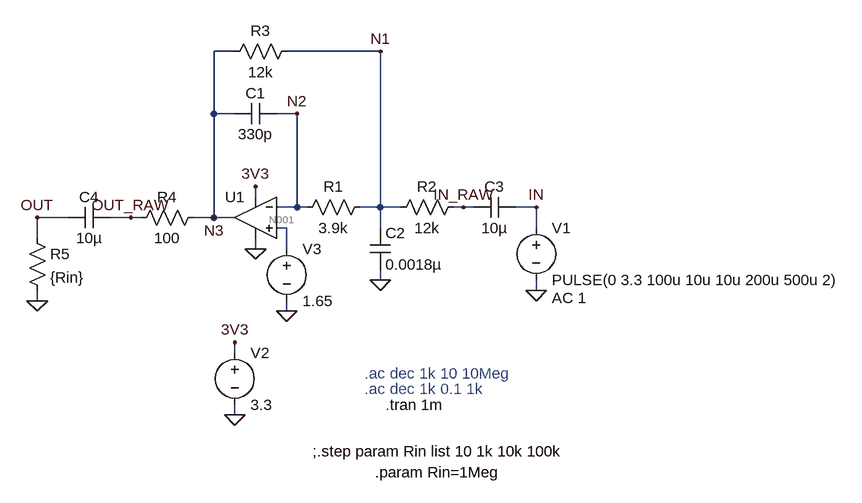
[diagram p0: schematic Preamp.asc]
Preamp.asc, the LTspice schematic file:
Version 4
SHEET 1 1140 680
WIRE 176 -96 144 -96
WIRE 400 -96 256 -96
WIRE 144 0 144 -96
WIRE 176 0 144 0
WIRE 272 0 240 0
WIRE 208 128 208 112
WIRE 272 144 272 0
WIRE 272 144 240 144
WIRE 288 144 272 144
WIRE 400 144 400 -96
WIRE 400 144 368 144
WIRE 432 144 400 144
WIRE 528 144 512 144
WIRE 544 144 528 144
WIRE 640 144 608 144
WIRE -80 160 -128 160
WIRE 16 160 -16 160
WIRE 32 160 16 160
WIRE 144 160 144 0
WIRE 144 160 112 160
WIRE 176 160 144 160
WIRE 256 176 240 176
WIRE 400 176 400 144
WIRE 640 176 640 144
WIRE -128 192 -128 160
WIRE 208 208 208 192
WIRE 256 208 256 176
WIRE 400 256 400 240
WIRE 640 272 640 256
WIRE -128 288 -128 272
WIRE 256 304 256 288
WIRE 176 368 176 352
WIRE 176 464 176 448
FLAG 208 208 0
FLAG 208 112 3V3
FLAG -128 288 0
FLAG 400 256 0
FLAG 640 272 0
FLAG 640 144 IN
FLAG -128 160 OUT
FLAG 16 160 OUT_RAW
FLAG 528 144 IN_RAW
FLAG 400 -96 N1
FLAG 272 0 N2
FLAG 144 160 N3
FLAG 176 464 0
FLAG 176 352 3V3
FLAG 256 304 0
SYMBOL OpAmps\\UniversalOpAmp2 208 160 M0
SYMATTR InstName U1
SYMBOL cap 240 -16 R90
WINDOW 0 0 32 VBottom 2
WINDOW 3 32 32 VTop 2
SYMATTR InstName C1
SYMATTR Value 330p
SYMBOL res 384 128 R90
WINDOW 0 0 56 VBottom 2
WINDOW 3 32 56 VTop 2
SYMATTR InstName R1
SYMATTR Value 3.9k
SYMBOL res 528 128 R90
WINDOW 0 0 56 VBottom 2
WINDOW 3 32 56 VTop 2
SYMATTR InstName R2
SYMATTR Value 12k
SYMBOL res 272 -112 R90
WINDOW 0 0 56 VBottom 2
WINDOW 3 32 56 VTop 2
SYMATTR InstName R3
SYMATTR Value 12k
SYMBOL cap 384 176 R0
SYMATTR InstName C2
SYMATTR Value 0.0018µ
SYMBOL cap 608 128 R90
WINDOW 0 0 32 VBottom 2
WINDOW 3 32 32 VTop 2
SYMATTR InstName C3
SYMATTR Value 10µ
SYMBOL res 128 144 R90
WINDOW 0 0 56 VBottom 2
WINDOW 3 32 56 VTop 2
SYMATTR InstName R4
SYMATTR Value 100
SYMBOL cap -16 144 R90
WINDOW 0 0 32 VBottom 2
WINDOW 3 32 32 VTop 2
SYMATTR InstName C4
SYMATTR Value 10µ
SYMBOL res -144 176 R0
SYMATTR InstName R5
SYMATTR Value {Rin}
SYMBOL voltage 640 160 R0
WINDOW 123 24 124 Left 2
WINDOW 39 0 0 Left 0
SYMATTR InstName V1
SYMATTR Value PULSE(0 3.3 100u 10u 10u 200u 500u 2)
SYMATTR Value2 AC 1
SYMBOL voltage 176 352 R0
WINDOW 123 0 0 Left 0
WINDOW 39 0 0 Left 0
SYMATTR InstName V2
SYMATTR Value 3.3
SYMBOL voltage 256 192 R0
WINDOW 123 0 0 Left 0
WINDOW 39 0 0 Left 0
SYMATTR InstName V3
SYMATTR Value 1.65
TEXT 376 400 Left 2 ;.ac dec 1k 10 10Meg
TEXT 376 424 Left 2 ;.ac dec 1k 0.1 1k
TEXT 296 520 Left 2 !;.step param Rin list 10 1k 10k 100k
TEXT 392 552 Left 2 !.param Rin=1Meg
TEXT 408 448 Left 2 !.tran 1m

The netlist it stands for:
* Preamp.asc
XU1 N001 N2 3V3 0 N3 level2 Avol=1Meg GBW=10Meg Slew=10Meg Ilimit=25m Rail=0 Vos=0 En=0 Enk=0 In=0 Ink=0 Rin=500Meg  ; pins In+ In- V+ V- OUT
C1 N2 N3 330p
R1 N1 N2 3.9k
R2 IN_RAW N1 12k
R3 N1 N3 12k
C2 N1 0 0.0018µ
C3 IN IN_RAW 10µ
R4 N3 OUT_RAW 100
C4 OUT_RAW OUT 10µ
R5 OUT 0 {Rin}
V1 IN 0 PULSE(0 3.3 100u 10u 10u 200u 500u 2) AC 1
V2 3V3 0 3.3
V3 N001 0 1.65
* .ac dec 1k 10 10Meg
* .ac dec 1k 0.1 1k
;.step param Rin list 10 1k 10k 100k
.param Rin=1Meg
.tran 1m
.lib UniversalOpAmp2.lib
.backanno
.end

* Results of the author's LTspice run, read from the files saved beside the schematic
* Operating Point, zero values left out:
*   V(n3) = 1.65 V
*   V(3v3) = 3.3 V
*   V(n2) = 1.65 V
*   V(n001) = 1.65 V
*   V(n1) = 1.65 V
*   V(in_raw) = 1.65 V
*   V(out_raw) = 1.65 V
*   I(V2) = -165 µA
*   Ix(u1:3) = 165 µA
*   Ix(u1:4) = -165 µA
*   Ix(u1:5) = 37.41 pA
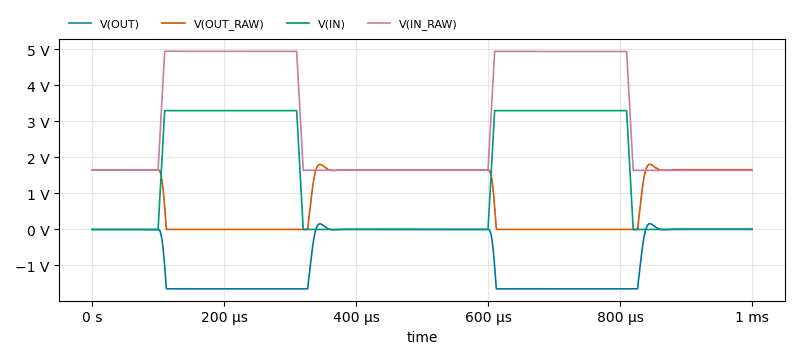
[diagram p1: Transient Analysis of Preamp.asc, plotted from the saved traces]
* Transient Analysis, 1 run:
*   V(OUT): min -1.649 V, max 161.6 mV, average -730.1 mV, rms 1.093 V, last 8.87 mV
*   V(OUT_RAW): min 1.364 mV, max 1.812 V, average 919.9 mV, rms 1.228 V, last 1.659 V
*   V(IN): min 0 V, max 3.3 V, average 1.386 V, rms 2.122 V, last 0 V
*   V(IN_RAW): min 1.641 V, max 4.95 V, average 3.031 V, rms 3.431 V, last 1.641 V